# Altium project Bode_Analyzer.PrjPcb
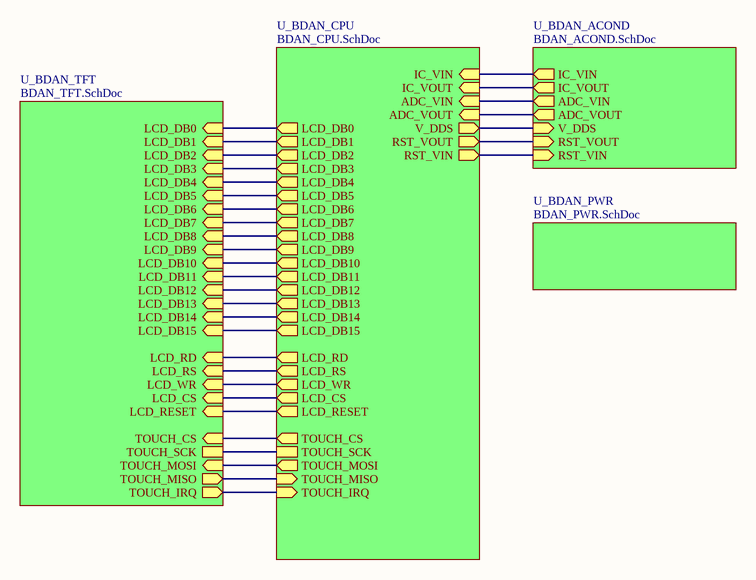
[diagram p0: BDAN.SchDoc]
5 sheets, 77 parts. Net scope: hierarchical (ports join the sheet entries above them; power ports are global).
Board file: Bode_Analyzer.PcbDoc
Sheets:
  BDAN.SchDoc
    U_BDAN_ACOND = BDAN_ACOND.SchDoc
    U_BDAN_CPU = BDAN_CPU.SchDoc
    U_BDAN_TFT = BDAN_TFT.SchDoc
    U_BDAN_PWR = BDAN_PWR.SchDoc

## Sheet BDAN.SchDoc
size A4; SheetNumber: 1; SheetTotal: 5

### Sub-sheets
U_BDAN_ACOND = BDAN_ACOND.SchDoc: IC_VIN (out), IC_VOUT (out), ADC_VIN (out), ADC_VOUT (out), V_DDS (in), RST_VOUT (in), RST_VIN (in)
U_BDAN_CPU = BDAN_CPU.SchDoc: V_DDS (out), LCD_WR (out), LCD_RD (out), LCD_DB8 (out), LCD_DB9 (out), LCD_DB10 (out), LCD_DB11 (out), LCD_DB12 (out), LCD_DB13 (out), LCD_DB14 (out), LCD_DB15 (out), LCD_DB2 (out), LCD_DB3 (out), LCD_DB4 (out), LCD_DB5 (out), LCD_DB6 (out), LCD_DB7 (out), TOUCH_SCK, TOUCH_CS (out), TOUCH_MOSI (out), TOUCH_MISO (in), LCD_DB1 (out), LCD_DB0 (out), LCD_RS (out), LCD_RESET (out), ADC_VIN (in), ADC_VOUT (in), TOUCH_IRQ (in), RST_VOUT (out), IC_VIN (in), LCD_CS (out), IC_VOUT (in), RST_VIN (out)
U_BDAN_PWR = BDAN_PWR.SchDoc: no entries
U_BDAN_TFT = BDAN_TFT.SchDoc: LCD_RS (in), LCD_WR (in), LCD_RD (in), LCD_DB8 (in), LCD_DB9 (in), LCD_DB10 (in), LCD_DB11 (in), LCD_DB12 (in), LCD_DB13 (in), LCD_DB14 (in), LCD_DB15 (in), LCD_CS (in), LCD_RESET (in), LCD_DB2 (in), LCD_DB3 (in), LCD_DB4 (in), LCD_DB5 (in), LCD_DB6 (in), LCD_DB7 (in), TOUCH_SCK, TOUCH_CS (in), TOUCH_MOSI (in), TOUCH_MISO (out), TOUCH_IRQ (out), LCD_DB1 (in), LCD_DB0 (in)

### Nets
DDS_MOSI: sheet U_BDAN_CPU/TOUCH_MOSI, sheet U_BDAN_TFT/TOUCH_MOSI
DDS_SCK: sheet U_BDAN_CPU/TOUCH_SCK, sheet U_BDAN_TFT/TOUCH_SCK
NetC3_1: sheet U_BDAN_ACOND/V_DDS, sheet U_BDAN_CPU/V_DDS
NetJ6_2: sheet U_BDAN_CPU/LCD_DB0, sheet U_BDAN_TFT/LCD_DB0
NetJ6_4: sheet U_BDAN_CPU/LCD_DB1, sheet U_BDAN_TFT/LCD_DB1
NetJ6_6: sheet U_BDAN_CPU/LCD_DB2, sheet U_BDAN_TFT/LCD_DB2
NetJ6_7: sheet U_BDAN_CPU/LCD_RS, sheet U_BDAN_TFT/LCD_RS
NetJ6_8: sheet U_BDAN_CPU/LCD_DB3, sheet U_BDAN_TFT/LCD_DB3
NetJ6_9: sheet U_BDAN_CPU/LCD_WR, sheet U_BDAN_TFT/LCD_WR
NetJ6_10: sheet U_BDAN_CPU/LCD_DB4, sheet U_BDAN_TFT/LCD_DB4
NetJ6_11: sheet U_BDAN_CPU/LCD_RD, sheet U_BDAN_TFT/LCD_RD
NetJ6_12: sheet U_BDAN_CPU/LCD_DB5, sheet U_BDAN_TFT/LCD_DB5
NetJ6_13: sheet U_BDAN_CPU/LCD_DB8, sheet U_BDAN_TFT/LCD_DB8
NetJ6_14: sheet U_BDAN_CPU/LCD_DB6, sheet U_BDAN_TFT/LCD_DB6
NetJ6_15: sheet U_BDAN_CPU/LCD_DB9, sheet U_BDAN_TFT/LCD_DB9
NetJ6_16: sheet U_BDAN_CPU/LCD_DB7, sheet U_BDAN_TFT/LCD_DB7
NetJ6_17: sheet U_BDAN_CPU/LCD_DB10, sheet U_BDAN_TFT/LCD_DB10
NetJ6_19: sheet U_BDAN_CPU/LCD_DB11, sheet U_BDAN_TFT/LCD_DB11
NetJ6_20: sheet U_BDAN_CPU/TOUCH_CS, sheet U_BDAN_TFT/TOUCH_CS
NetJ6_21: sheet U_BDAN_CPU/LCD_DB12, sheet U_BDAN_TFT/LCD_DB12
NetJ6_23: sheet U_BDAN_CPU/LCD_DB13, sheet U_BDAN_TFT/LCD_DB13
NetJ6_25: sheet U_BDAN_CPU/LCD_DB14, sheet U_BDAN_TFT/LCD_DB14
NetJ6_26: sheet U_BDAN_CPU/TOUCH_MISO, sheet U_BDAN_TFT/TOUCH_MISO
NetJ6_27: sheet U_BDAN_CPU/LCD_DB15, sheet U_BDAN_TFT/LCD_DB15
NetJ6_28: sheet U_BDAN_CPU/TOUCH_IRQ, sheet U_BDAN_TFT/TOUCH_IRQ
NetJ6_29: sheet U_BDAN_CPU/LCD_CS, sheet U_BDAN_TFT/LCD_CS
NetJ6_33: sheet U_BDAN_CPU/LCD_RESET, sheet U_BDAN_TFT/LCD_RESET
NetR6_1: sheet U_BDAN_ACOND/IC_VIN, sheet U_BDAN_CPU/IC_VIN
NetR11_1: sheet U_BDAN_ACOND/IC_VOUT, sheet U_BDAN_CPU/IC_VOUT
NetR13_1: sheet U_BDAN_ACOND/RST_VIN, sheet U_BDAN_CPU/RST_VIN
NetR14_1: sheet U_BDAN_ACOND/RST_VOUT, sheet U_BDAN_CPU/RST_VOUT
NetU1_35_B: sheet U_BDAN_ACOND/ADC_VIN, sheet U_BDAN_CPU/ADC_VIN
NetU1_37_B: sheet U_BDAN_ACOND/ADC_VOUT, sheet U_BDAN_CPU/ADC_VOUT

## Sheet BDAN_ACOND.SchDoc
size A4; SheetNumber: 3; SheetTotal: 5
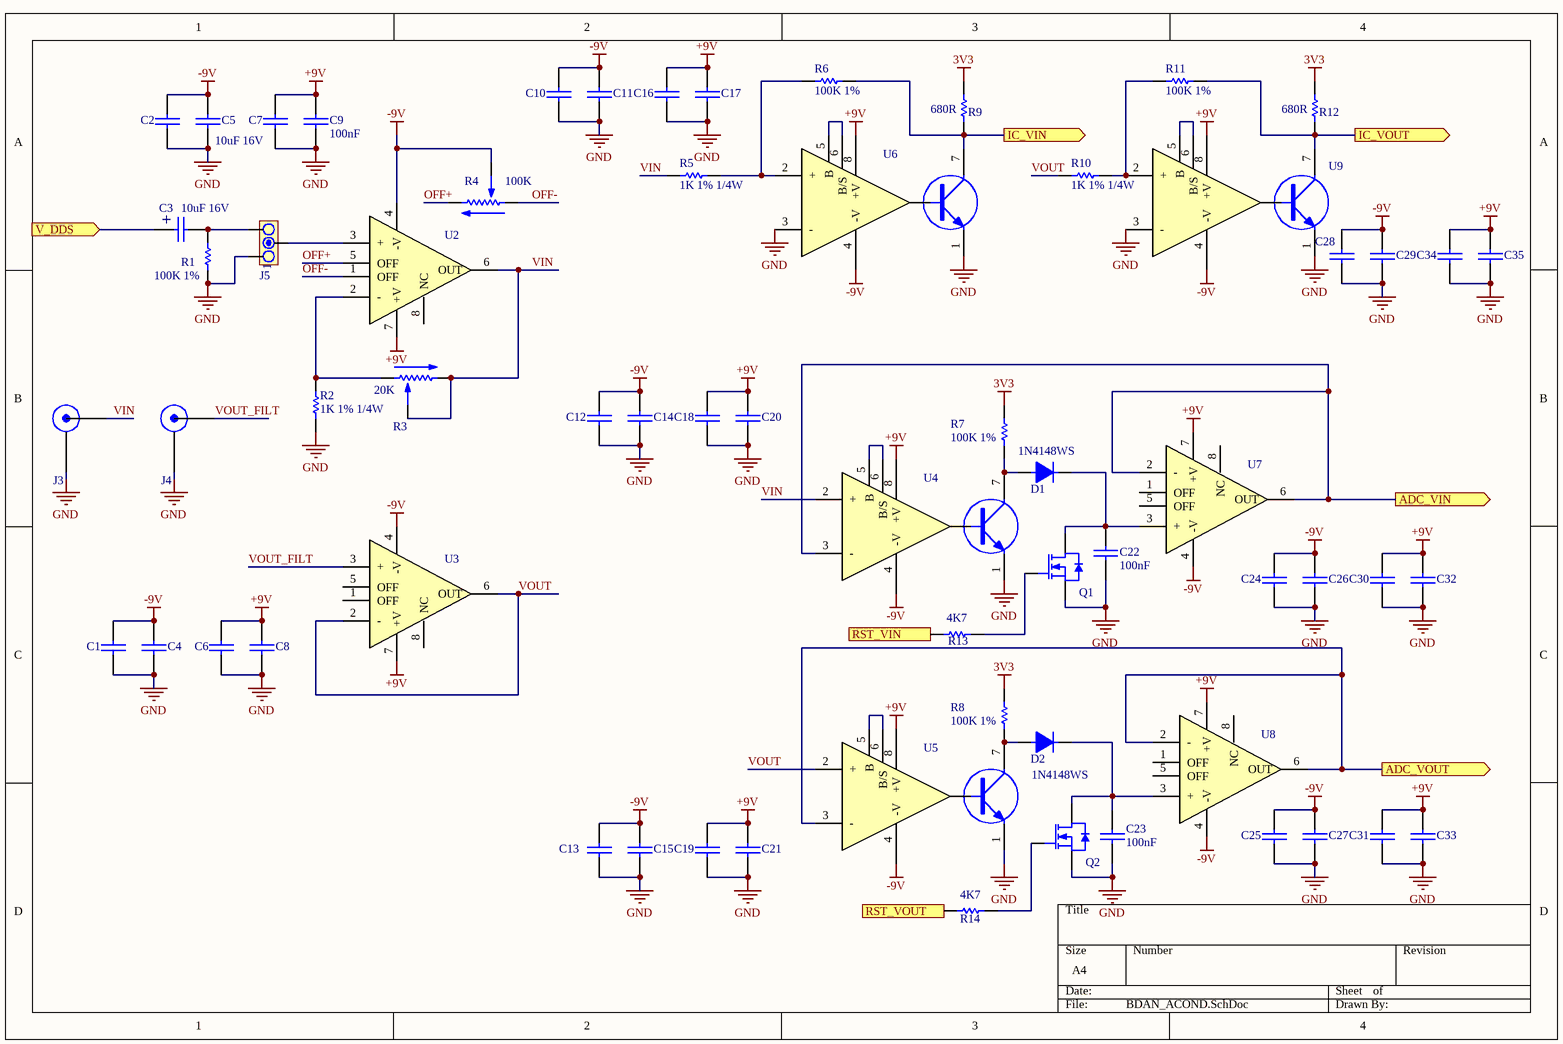
[diagram p1: BDAN_ACOND.SchDoc]

### Parts
C1  100nF  [0805]  (value not drawn)
C2  100nF  [0805]  (value not drawn)
C3  10uF 16V  [CAP318]
C4  10uF 16V  [0805]  (value not drawn)
C5  10uF 16V  [0805]  (value not drawn)
C6  10uF 16V  [0805]  (value not drawn)
C7  10uF 16V  [0805]
C8  100nF  [0805]  (value not drawn)
C9  100nF  [0805]
C10  100nF  [0805]  (value not drawn)
C11  10uF 16V  [0805]  (value not drawn)
C12  100nF  [0805]  (value not drawn)
C13  100nF  [0805]  (value not drawn)
C14  10uF 16V  [0805]  (value not drawn)
C15  10uF 16V  [0805]  (value not drawn)
C16  10uF 16V  [0805]  (value not drawn)
C17  100nF  [0805]  (value not drawn)
C18  10uF 16V  [0805]  (value not drawn)
C19  10uF 16V  [0805]  (value not drawn)
C20  100nF  [0805]  (value not drawn)
C21  100nF  [0805]  (value not drawn)
C22  100nF  [CAP508]
C23  100nF  [CAP508]
C24  100nF  [0805]  (value not drawn)
C25  100nF  [0805]  (value not drawn)
C26  10uF 16V  [0805]  (value not drawn)
C27  10uF 16V  [0805]  (value not drawn)
C28  100nF  [0805]  (value not drawn)
C29  10uF 16V  [0805]  (value not drawn)
C30  10uF 16V  [0805]  (value not drawn)
C31  10uF 16V  [0805]  (value not drawn)
C32  100nF  [0805]  (value not drawn)
C33  100nF  [0805]  (value not drawn)
C34  10uF 16V  [0805]  (value not drawn)
C35  100nF  [0805]  (value not drawn)
D1  1N4148WS  [SOD323F]
D2  1N4148WS  [SOD323F]
J3  BNC  [BNC]  (value not drawn)
J4  BNC  [BNC]  (value not drawn)
J5  JUMPER3  [JUMPER3]  (value not drawn)
Q1  2N7000  [TO92_DGS]  (value not drawn)
Q2  2N7000  [TO92_DGS]  (value not drawn)
R1  100K 1%  [0805]
R2  1K 1% 1/4W  [0805]
R3  20K  [3296W-TOP]
R4  100K  [3296W-TOP]
R5  1K 1% 1/4W  [0805]
R6  100K 1%  [0805]
R7  100K 1%  [0805]
R8  100K 1%  [0805]
R9  680R  [0805]
R10  1K 1% 1/4W  [0805]
R11  100K 1%  [0805]
R12  680R  [0805]
R13  4K7  [0805]
R14  4K7  [0805]
U2  OPA604APG4  [DIP8]  (value not drawn)
U3  OPA604APG4  [DIP8]  (value not drawn)
U4  LM311M  [DIP8]  (value not drawn)
U5  LM311M  [DIP8]  (value not drawn)
U6  LM311M  [DIP8]  (value not drawn)
U7  OPA604APG4  [DIP8]  (value not drawn)
U8  OPA604APG4  [DIP8]  (value not drawn)
U9  LM311M  [DIP8]  (value not drawn)

### Ports
ADC_VIN (out), ADC_VOUT (out), IC_VIN (out), IC_VOUT (out), RST_VIN (in), RST_VOUT (in), V_DDS (in)

### Nets
3V3: R7.2 R8.2 R9.2 R12.2
+9V: C6.1 C7.1 C8.1 C9.1 C16.1 C17.1 C18.1 C19.1 C20.1 C21.1 C30.1 C31.1 C32.1 C33.1 C34.1 C35.1 U2.7(+V) U3.7(+V) U4.8(+V) U5.8(+V) U6.8(+V) U7.7(+V) U8.7(+V) U9.8(+V)
-9V: C1.1 C2.1 C4.1 C5.1 C10.1 C11.1 C12.1 C13.1 C14.1 C15.1 C24.1 C25.1 C26.1 C27.1 C28.1 C29.1 R4.2(WIPER) U2.4(-V) U3.4(-V) U4.4(-V) U5.4(-V) U6.4(-V) U7.4(-V) U8.4(-V) U9.4(-V)
GND: C1.2 C2.2 C4.2 C5.2 C6.2 C7.2 C8.2 C9.2 C10.2 C11.2 C12.2 C13.2 C14.2 C15.2 C16.2 C17.2 C18.2 C19.2 C20.2 C21.2 C22.2 C23.2 C24.2 C25.2 C26.2 C27.2 C28.2 C29.2 C30.2 C31.2 C32.2 C33.2 C34.2 C35.2 J3.1 J4.1 J5.1 Q1.3(S) Q2.3(S) R1.1 R2.1 U4.1(EMIT_OUT) U5.1(EMIT_OUT) U6.1(EMIT_OUT) U6.3(-) U9.1(EMIT_OUT) U9.3(-)
OFF+: R4.3(CW) U2.5(OFF)
OFF-: R4.1(CCW) U2.1(OFF)
VIN: J3.2 R3.2(WIPER) R3.3(CW) R5.2 U2.6(OUT) U4.2(+)
VOUT: R10.2 U3.2(-) U3.6(OUT) U5.2(+)
VOUT_FILT: J4.2 U3.3(+)
NetC3_1: C3.1 ; port V_DDS
NetC3_2: C3.2 J5.3 R1.2
NetC22_1: C22.1 D1.2 Q1.2(D) U7.3(+)
NetC23_1: C23.1 D2.2 Q2.2(D) U8.3(+)
NetD1_1: D1.1 R7.1 U4.7(COL_OUT)
NetD2_1: D2.1 R8.1 U5.7(COL_OUT)
NetJ5_2: J5.2 U2.3(+)
NetQ1_1: Q1.1(G) R13.2
NetQ2_1: Q2.1(G) R14.2
NetR2_2: R2.2 R3.1(CCW) U2.2(-)
NetR5_1: R5.1 R6.2 U6.2(+)
NetR6_1: R6.1 R9.1 U6.7(COL_OUT) ; port IC_VIN
NetR10_1: R10.1 R11.2 U9.2(+)
NetR11_1: R11.1 R12.1 U9.7(COL_OUT) ; port IC_VOUT
NetR13_1: R13.1 ; port RST_VIN
NetR14_1: R14.1 ; port RST_VOUT
NetU1_35_B: U4.3(-) U7.2(-) U7.6(OUT) ; port ADC_VIN
NetU1_37_B: U5.3(-) U8.2(-) U8.6(OUT) ; port ADC_VOUT
NetU4_5: U4.5(B) U4.6(B/S)
NetU5_5: U5.5(B) U5.6(B/S)
NetU6_5: U6.5(B) U6.6(B/S)
NetU9_5: U9.5(B) U9.6(B/S)

Not connected (* = marked no-connect by the designer): U2 8(NC); U3 1(OFF) 5(OFF) 8(NC); U7 1(OFF) 5(OFF) 8(NC); U8 1(OFF) 5(OFF) 8(NC)

### Notes on the sheet
- (in symbol CAP_TAN_10uF_16V_CAP318) +

### Library data of the parts
C1 C2 C8-C10 C12 C13 C17 C20 C21 C24 C25 C28 C32 C33 C35 = CAP0805_100nF_X7R: CAP0805 100nF X7R; CREO: CP; Part Number: CAP0805_100nF_X7R; Value: 100nF
C3 = CAP_TAN_10uF_16V_CAP318: CAP TANT 10UF 10% 16V RADIAL; Manufacturer: KYOCERA AVX; Manufacturer Part Number: TAP106K016CRS; CREO: JP; Part Number: CAP_TAN_10uF_16V_CAP318; Value: 10uF 16V; Supplier 1: Digi-Key; Supplier Part Number 1: 478-TAP106K016CRSCT-ND; APROBO: -
C4-C7 C11 C14-C16 C18 C19 C26 C27 C29-C31 C34 = CAP0805_10uF_16V_X5R: CAP0805 10uF 16V X5R; Manufacturer: TDK Corporation; Manufacturer Part Number: C2012X5R1C106K085AC; CREO: AP; Part Number: CAP0805_10uF_16V_X5R; Value: 10uF 16V; Supplier 1: Digi-Key; Supplier Part Number 1: 445-7644-1-ND
C22 C23 = CAP_CER_100nF_250V_CAP508: CAP CER RAD 100NF 250V C0G 10%; CREO: JP; Part Number: CAP_CER_100nF_250V_CAP508; Value: 100nF; Supplier 1: Digi-Key; APROBO: -
D1 D2 = 1N4148_SOD323F: DIODE 75V 150MA SOD323F; CREO: EB; Part Number: 1N4148_SOD323F; Value: 1N4148WS; Supplier 1: Digi-Key; Supplier Part Number 1: 1N4148WSFSTR-ND
J3 J4 = BNC: CONN BNC RCPT STR 50 OHM PCB; Manufacturer: Amphenol RF; Manufacturer Part Number: 112404; Publico: JP; Part Number: BNC; Value: BNC; Supplier 1: Digi-Key; Supplier Part Number 1: ACX1051-ND
J5 = JUMPER3_TH: TIRA DE PINES 1x3 0.1" + JUMPER; Manufacturer: Harwin Inc.; Manufacturer Part Number: M20-9990345; Publico: EB; Part Number: JUMPER3_TH; Value: JUMPER3; Supplier 1: Digi-Key; Supplier Part Number 1: 952-2263-ND; Aprobo: -
Q1 Q2 = 2N7000_TO92: MOSFET N-CH 60V 200MA TO-92; Publico: EB; Part Number: 2N7000_TO92; Value: 2N7000; Aprobo: -
R1 R6-R8 R11 = RES0805_100K_1%: RES0805 100K 1%; Manufacturer: Stackpole Electronics Inc; Manufacturer Part Number: RMCF0805FG100K; Publico: EB; Part Number: RES0805_100K_1%; Value: 100K 1%; Supplier 1: Digi-Key; Supplier Part Number 1: RMCF0805FG100KCT-ND; Aprobo: -
R2 R5 R10 = RES0805_1K_1%: RES SMD 1K OHM 1% 1/4W 0805; Manufacturer: Stackpole Electronics Inc; Manufacturer Part Number: RNCP0805FTD1K00; Publico: JS; Part Number: RES0805_1K_1%; Value: 1K 1% 1/4W; Supplier 1: Digi-Key; Supplier Part Number 1: RNCP0805FTD1K00TR-ND; Aprobo: -
R3 = TRIMMER_3296W_20K: 3296 TRIMMER 20K OHM 0.5W PC PIN; Manufacturer: Bourns Inc.; Manufacturer Part Number: 3296W-1-203; Publico: JP; Part Number: TRIMMER_3296W_20K; Value: 20K; Supplier 1: Digi-Key; Supplier Part Number 1: 3296W-203-ND; Aprobo: -
R4 = TRIMMER_3296W_100K_MULTI: 3296 TRIMMER 100K OHM 0.5W PC PIN; Manufacturer: Bourns Inc.; Manufacturer Part Number: 3296W-1-104LF; Publico: JP; Part Number: TRIMMER_3296W_100K_MULTI; Value: 100K; Supplier 1: Digi-Key; Supplier Part Number 1: 3296W-104LF-ND; Aprobo: -
R9 R12 = RES0805_680R_1%: RES0805 680R 1%; Manufacturer: Stackpole Electronics Inc; Manufacturer Part Number: RMCF0805FT680R; Publico: JP; Part Number: RES0805_680R_1%; Value: 680R; Supplier 1: Digi-Key; Supplier Part Number 1: RMCF0805FT680RCT-ND; Aprobo: -
R13 R14 = RES0805_4K7_5%: RES0805 4K7 5%; Manufacturer: Stackpole Electronics Inc; Publico: EB; Part Number: RES0805_4K7_5%; Value: 4K7; Supplier 1: Digi-Key; Supplier Part Number 1: RMCF0805JT4K70TR-ND; Aprobo: -
U2 U3 U7 U8 = OPA604APG4: IC OPAMP GP 1 CIRCUIT 8DIP; Manufacturer: Texas Instruments; Publico: JP; Part Number: OPA604APG4; Value: OPA604APG4; Manufacturer Part Number: OPA604APG4; Supplier 1: Digi-Key; Supplier Part Number 1: OPA604APG4-ND; Aprobo: -
U4-U6 U9 = LM311N: IC VOLTAGE COMPARATOR 8-SOIC; Part Number: LM311N; Publico: EB; Value: LM311M; Supplier 1: Digi-Key; Supplier Part Number 1: LM311MNS/NOPB-ND; Aprobo: -

## Sheet BDAN_CPU.SchDoc
size A4; SheetNumber: 2; SheetTotal: 5
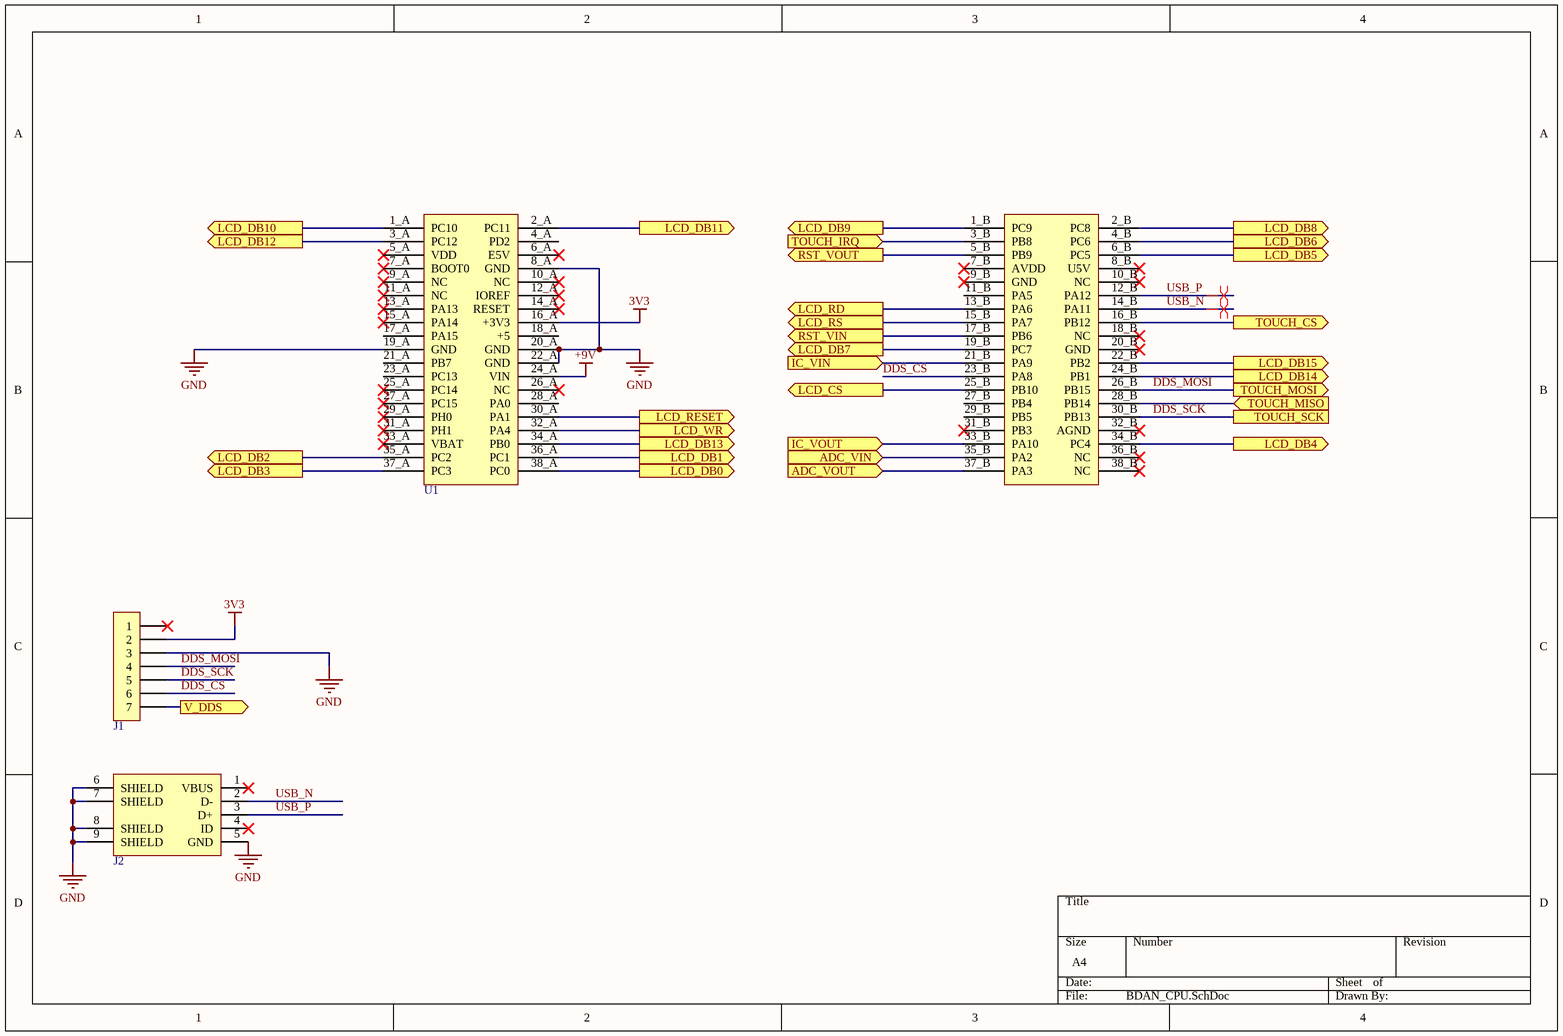
[diagram p2: BDAN_CPU.SchDoc]

### Parts
J1  RECEPTACULO 7POS 0.1"  [SIPF7]  (value not drawn)
J2  MINIUSB_FEMALE_SMD  [USB_MINI_FEMALE]  (value not drawn)
U1  NUCLEO-F401RE  [NUCLEO-F401RE]  (value not drawn)

### Ports
ADC_VIN (in), ADC_VOUT (in), IC_VIN (in), IC_VOUT (in), LCD_CS (out), LCD_DB0 (out), LCD_DB1 (out), LCD_DB2 (out), LCD_DB3 (out), LCD_DB4 (out), LCD_DB5 (out), LCD_DB6 (out), LCD_DB7 (out), LCD_DB8 (out), LCD_DB9 (out), LCD_DB10 (out), LCD_DB11 (out), LCD_DB12 (out), LCD_DB13 (out), LCD_DB14 (out), LCD_DB15 (out), LCD_RD (out), LCD_RESET (out), LCD_RS (out), LCD_WR (out), RST_VIN (out), RST_VOUT (out), TOUCH_CS (out), TOUCH_IRQ (in), TOUCH_MISO (in), TOUCH_MOSI (out), TOUCH_SCK, V_DDS (out)

### Nets
3V3: J1.2 U1.16_A(+3V3)
+9V: U1.24_A(VIN)
GND: J1.3 J2.5(GND) J2.6(SHIELD) J2.7(SHIELD) J2.8(SHIELD) J2.9(SHIELD) U1.8_A(GND) U1.19_A(GND) U1.20_A(GND) U1.22_A(GND)
DDS_CS: J1.6 U1.23_B(PA8)
DDS_MOSI: J1.4 U1.26_B(PB15) ; port TOUCH_MOSI
DDS_SCK: J1.5 U1.30_B(PB13) ; port TOUCH_SCK
USB_N: J2.2(D-) U1.14_B(PA11)
USB_P: J2.3(D+) U1.12_B(PA12)
NetC3_1: J1.7 ; port V_DDS
NetJ6_2: U1.38_A(PC0) ; port LCD_DB0
NetJ6_4: U1.36_A(PC1) ; port LCD_DB1
NetJ6_6: U1.35_A(PC2) ; port LCD_DB2
NetJ6_7: U1.15_B(PA7) ; port LCD_RS
NetJ6_8: U1.37_A(PC3) ; port LCD_DB3
NetJ6_9: U1.32_A(PA4) ; port LCD_WR
NetJ6_10: U1.34_B(PC4) ; port LCD_DB4
NetJ6_11: U1.13_B(PA6) ; port LCD_RD
NetJ6_12: U1.6_B(PC5) ; port LCD_DB5
NetJ6_13: U1.2_B(PC8) ; port LCD_DB8
NetJ6_14: U1.4_B(PC6) ; port LCD_DB6
NetJ6_15: U1.1_B(PC9) ; port LCD_DB9
NetJ6_16: U1.19_B(PC7) ; port LCD_DB7
NetJ6_17: U1.1_A(PC10) ; port LCD_DB10
NetJ6_19: U1.2_A(PC11) ; port LCD_DB11
NetJ6_20: U1.16_B(PB12) ; port TOUCH_CS
NetJ6_21: U1.3_A(PC12) ; port LCD_DB12
NetJ6_23: U1.34_A(PB0) ; port LCD_DB13
NetJ6_25: U1.24_B(PB1) ; port LCD_DB14
NetJ6_26: U1.28_B(PB14) ; port TOUCH_MISO
NetJ6_27: U1.22_B(PB2) ; port LCD_DB15
NetJ6_28: U1.3_B(PB8) ; port TOUCH_IRQ
NetJ6_29: U1.25_B(PB10) ; port LCD_CS
NetJ6_33: U1.30_A(PA1) ; port LCD_RESET
NetR6_1: U1.21_B(PA9) ; port IC_VIN
NetR11_1: U1.33_B(PA10) ; port IC_VOUT
NetR13_1: U1.17_B(PB6) ; port RST_VIN
NetR14_1: U1.5_B(PB9) ; port RST_VOUT
NetU1_35_B: U1.35_B(PA2) ; port ADC_VIN
NetU1_37_B: U1.37_B(PA3) ; port ADC_VOUT

Not connected (* = marked no-connect by the designer): J1 1*; J2 1(VBUS)* 4(ID)*; U1 4_A(PD2) 5_A(VDD)* 6_A(E5V)* 7_A(BOOT0)* 7_B(AVDD)* 8_B(U5V)* 9_A(NC)* 9_B(GND)* 10_A(NC)* 10_B(NC)* 11_A(NC)* 11_B(PA5) 12_A(IOREF)* 13_A(PA13)* 14_A(RESET)* 15_A(PA14)* 17_A(PA15) 18_A(+5) 18_B(NC)* 20_B(GND)* 21_A(PB7) 23_A(PC13) 25_A(PC14)* 26_A(NC)* 27_A(PC15)* 27_B(PB4) 28_A(PA0) 29_A(PH0)* 29_B(PB5) 31_A(PH1)* 31_B(PB3)* 32_B(AGND)* 33_A(VBAT)* 36_B(NC)* 38_B(NC)*

### Layout directives
differential pair: USB_N, USB_P

### Library data of the parts
J1 = RECEPTACLE_7POS_0.1": RECEPTACULO 1x7 POS 0.1"; Publico: JP; Part Number: RECEPTACLE_7POS_0.1"; Value: RECEPTACULO 7POS 0.1"; Supplier 1: ElectroComponentes; Aprobo: -
J2 = CON_MINIUSB_FEMALE_SMD: CONECTOR MINIUSB FEMALE_SMD; Publico: EB; Part Number: CON_MINIUSB_FEMALE_SMD; Value: MINIUSB_FEMALE_SMD; Supplier 1: ElectroComponentes; Aprobo: -
U1 = NUCLEO-F401RE: Manufacturer: STMicroelectronics; Publico: JP; Part Number: NUCLEO-F401RE; Value: NUCLEO-F401RE; Manufacturer Part Number: NUCLEO-F401RE; Supplier 1: Digi-Key

## Sheet BDAN_TFT.SchDoc
size A4; SheetNumber: 4; SheetTotal: 5
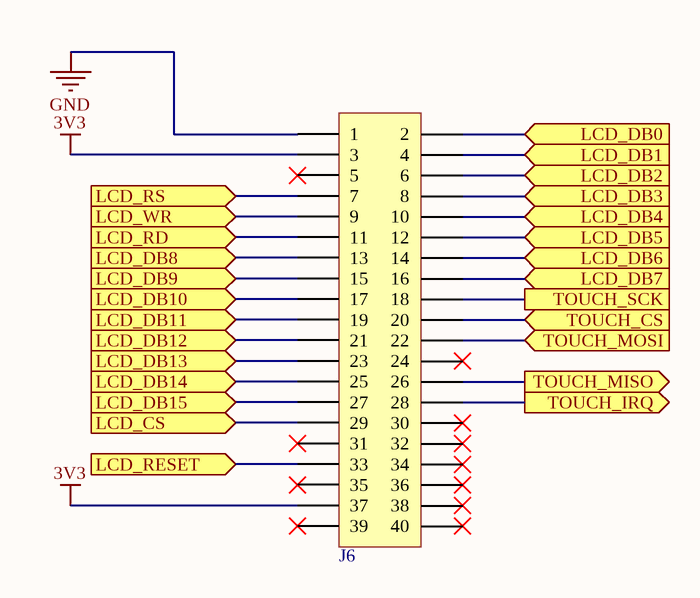
[diagram p3: BDAN_TFT.SchDoc]

### Parts
J6  ILI9341  [ILI9341]  (value not drawn)

### Ports
LCD_CS (in), LCD_DB0 (in), LCD_DB1 (in), LCD_DB2 (in), LCD_DB3 (in), LCD_DB4 (in), LCD_DB5 (in), LCD_DB6 (in), LCD_DB7 (in), LCD_DB8 (in), LCD_DB9 (in), LCD_DB10 (in), LCD_DB11 (in), LCD_DB12 (in), LCD_DB13 (in), LCD_DB14 (in), LCD_DB15 (in), LCD_RD (in), LCD_RESET (in), LCD_RS (in), LCD_WR (in), TOUCH_CS (in), TOUCH_IRQ (out), TOUCH_MISO (out), TOUCH_MOSI (in), TOUCH_SCK

### Nets
3V3: J6.3 J6.37
GND: J6.1
DDS_MOSI: J6.22 ; port TOUCH_MOSI
DDS_SCK: J6.18 ; port TOUCH_SCK
NetJ6_2: J6.2 ; port LCD_DB0
NetJ6_4: J6.4 ; port LCD_DB1
NetJ6_6: J6.6 ; port LCD_DB2
NetJ6_7: J6.7 ; port LCD_RS
NetJ6_8: J6.8 ; port LCD_DB3
NetJ6_9: J6.9 ; port LCD_WR
NetJ6_10: J6.10 ; port LCD_DB4
NetJ6_11: J6.11 ; port LCD_RD
NetJ6_12: J6.12 ; port LCD_DB5
NetJ6_13: J6.13 ; port LCD_DB8
NetJ6_14: J6.14 ; port LCD_DB6
NetJ6_15: J6.15 ; port LCD_DB9
NetJ6_16: J6.16 ; port LCD_DB7
NetJ6_17: J6.17 ; port LCD_DB10
NetJ6_19: J6.19 ; port LCD_DB11
NetJ6_20: J6.20 ; port TOUCH_CS
NetJ6_21: J6.21 ; port LCD_DB12
NetJ6_23: J6.23 ; port LCD_DB13
NetJ6_25: J6.25 ; port LCD_DB14
NetJ6_26: J6.26 ; port TOUCH_MISO
NetJ6_27: J6.27 ; port LCD_DB15
NetJ6_28: J6.28 ; port TOUCH_IRQ
NetJ6_29: J6.29 ; port LCD_CS
NetJ6_33: J6.33 ; port LCD_RESET

Not connected (* = marked no-connect by the designer): J6 5* 24* 30* 31* 32* 34* 35* 36* 38* 39* 40*

### Library data of the parts
J6 = ILI9341-3.2: ILI9341-3.2''; Publico: JP; Part Number: ILI9341-3.2; Value: ILI9341; Aprobo: -

## Sheet BDAN_PWR.SchDoc
size A4; SheetNumber: 5; SheetTotal: 5
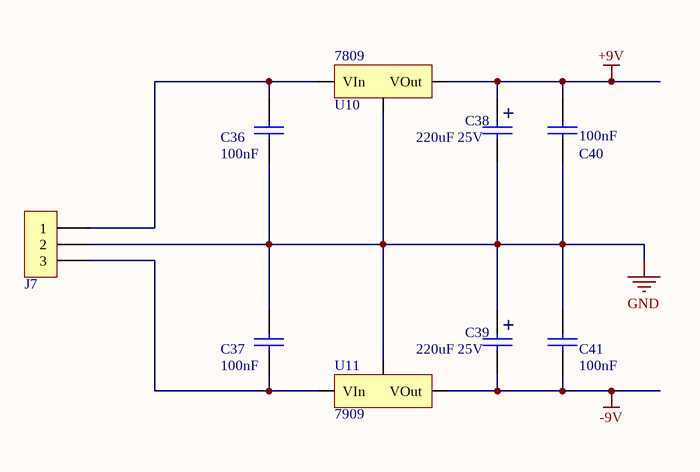
[diagram p4: BDAN_PWR.SchDoc]

### Parts
C36  100nF  [0805]
C37  100nF  [0805]
C38  220uF 25V  [CAP300RP]
C39  220uF 25V  [CAP300RP]
C40  100nF  [0805]
C41  100nF  [0805]
J7  1984620  [BORNERA3_3.5MM]  (value not drawn)
U10  7809  [TO220-V]
U11  7909  [TO220-V]

### Nets
+9V: C38.1 C40.1 U10.3(VOut)
-9V: C39.2 C41.2 U11.3(VOut)
GND: C36.2 C37.1 C38.2 C39.1 C40.2 C41.1 J7.2 U10.2(GND) U11.1(GND)
NetC36_1: C36.1 J7.1 U10.1(VIn)
NetC37_2: C37.2 J7.3 U11.2(VIn)

### Notes on the sheet
- (in symbol CAP_ELECT_220uF_25V) +

### Library data of the parts
C36 C37 C40 C41 = CAP0805_100nF_X7R: CAP0805 100nF X7R; CREO: CP; Part Number: CAP0805_100nF_X7R; Value: 100nF
C38 C39 = CAP_ELECT_220uF_25V: CAP ELECT 220uF 25V; Manufacturer: Nichicon; Manufacturer Part Number: UVR1E221MPD1TA; CREO: MM; Part Number: CAP_ELECT_220uF_25V; Value: 220uF 25V; Supplier 1: Digi-Key; Supplier Part Number 1: 493-6097-3-ND; APROBO: -
J7 = BORNERA_3_3.5MM_TORNILLO: TERM BLK 3P SIDE ENT 3.5MM PCB; Manufacturer: Phoenix Contact; Publico: AP; Part Number: BORNERA_3_3.5MM_TORNILLO; Value: 1984620; Manufacturer Part Number: 1984620; Supplier 1: Digi-Key; Supplier Part Number 1: 277-1722-ND; Aprobo: -
U10 = 7809: IC REG LDO 9V 1.5A TO220; Publico: JP; Part Number: 7809; Value: 7809; Supplier 1: ElectroComponentes
U11 = 7909: IC REG LDO -9V 1.5A TO220; Publico: JP; Part Number: 7909; Value: 7909; Supplier 1: ElectroComponentes

## Nets that join several sheets
3V3: BDAN_ACOND (R7.2 R8.2 R9.2 R12.2), BDAN_CPU (J1.2 U1.16_A), BDAN_TFT (J6.3 J6.37)
+9V: BDAN_ACOND (24 pins), BDAN_CPU (U1.24_A), BDAN_PWR (C38.1 C40.1 U10.3)
-9V: BDAN_ACOND (25 pins), BDAN_PWR (C39.2 C41.2 U11.3)
GND: BDAN_ACOND (47 pins), BDAN_CPU (10 pins), BDAN_TFT (J6.1), BDAN_PWR (9 pins)
DDS_MOSI: BDAN_CPU (J1.4 U1.26_B), BDAN_TFT (J6.22)
DDS_SCK: BDAN_CPU (J1.5 U1.30_B), BDAN_TFT (J6.18)
NetC3_1: BDAN_ACOND (C3.1), BDAN_CPU (J1.7)
NetJ6_2: BDAN_CPU (U1.38_A), BDAN_TFT (J6.2)
NetJ6_4: BDAN_CPU (U1.36_A), BDAN_TFT (J6.4)
NetJ6_6: BDAN_CPU (U1.35_A), BDAN_TFT (J6.6)
NetJ6_7: BDAN_CPU (U1.15_B), BDAN_TFT (J6.7)
NetJ6_8: BDAN_CPU (U1.37_A), BDAN_TFT (J6.8)
NetJ6_9: BDAN_CPU (U1.32_A), BDAN_TFT (J6.9)
NetJ6_10: BDAN_CPU (U1.34_B), BDAN_TFT (J6.10)
NetJ6_11: BDAN_CPU (U1.13_B), BDAN_TFT (J6.11)
NetJ6_12: BDAN_CPU (U1.6_B), BDAN_TFT (J6.12)
NetJ6_13: BDAN_CPU (U1.2_B), BDAN_TFT (J6.13)
NetJ6_14: BDAN_CPU (U1.4_B), BDAN_TFT (J6.14)
NetJ6_15: BDAN_CPU (U1.1_B), BDAN_TFT (J6.15)
NetJ6_16: BDAN_CPU (U1.19_B), BDAN_TFT (J6.16)
NetJ6_17: BDAN_CPU (U1.1_A), BDAN_TFT (J6.17)
NetJ6_19: BDAN_CPU (U1.2_A), BDAN_TFT (J6.19)
NetJ6_20: BDAN_CPU (U1.16_B), BDAN_TFT (J6.20)
NetJ6_21: BDAN_CPU (U1.3_A), BDAN_TFT (J6.21)
NetJ6_23: BDAN_CPU (U1.34_A), BDAN_TFT (J6.23)
NetJ6_25: BDAN_CPU (U1.24_B), BDAN_TFT (J6.25)
NetJ6_26: BDAN_CPU (U1.28_B), BDAN_TFT (J6.26)
NetJ6_27: BDAN_CPU (U1.22_B), BDAN_TFT (J6.27)
NetJ6_28: BDAN_CPU (U1.3_B), BDAN_TFT (J6.28)
NetJ6_29: BDAN_CPU (U1.25_B), BDAN_TFT (J6.29)
NetJ6_33: BDAN_CPU (U1.30_A), BDAN_TFT (J6.33)
NetR6_1: BDAN_ACOND (R6.1 R9.1 U6.7), BDAN_CPU (U1.21_B)
NetR11_1: BDAN_ACOND (R11.1 R12.1 U9.7), BDAN_CPU (U1.33_B)
NetR13_1: BDAN_ACOND (R13.1), BDAN_CPU (U1.17_B)
NetR14_1: BDAN_ACOND (R14.1), BDAN_CPU (U1.5_B)
NetU1_35_B: BDAN_ACOND (U4.3 U7.2 U7.6), BDAN_CPU (U1.35_B)
NetU1_37_B: BDAN_ACOND (U5.3 U8.2 U8.6), BDAN_CPU (U1.37_B)